# Altium schematic sheet stm32f1.SchDoc
size A3
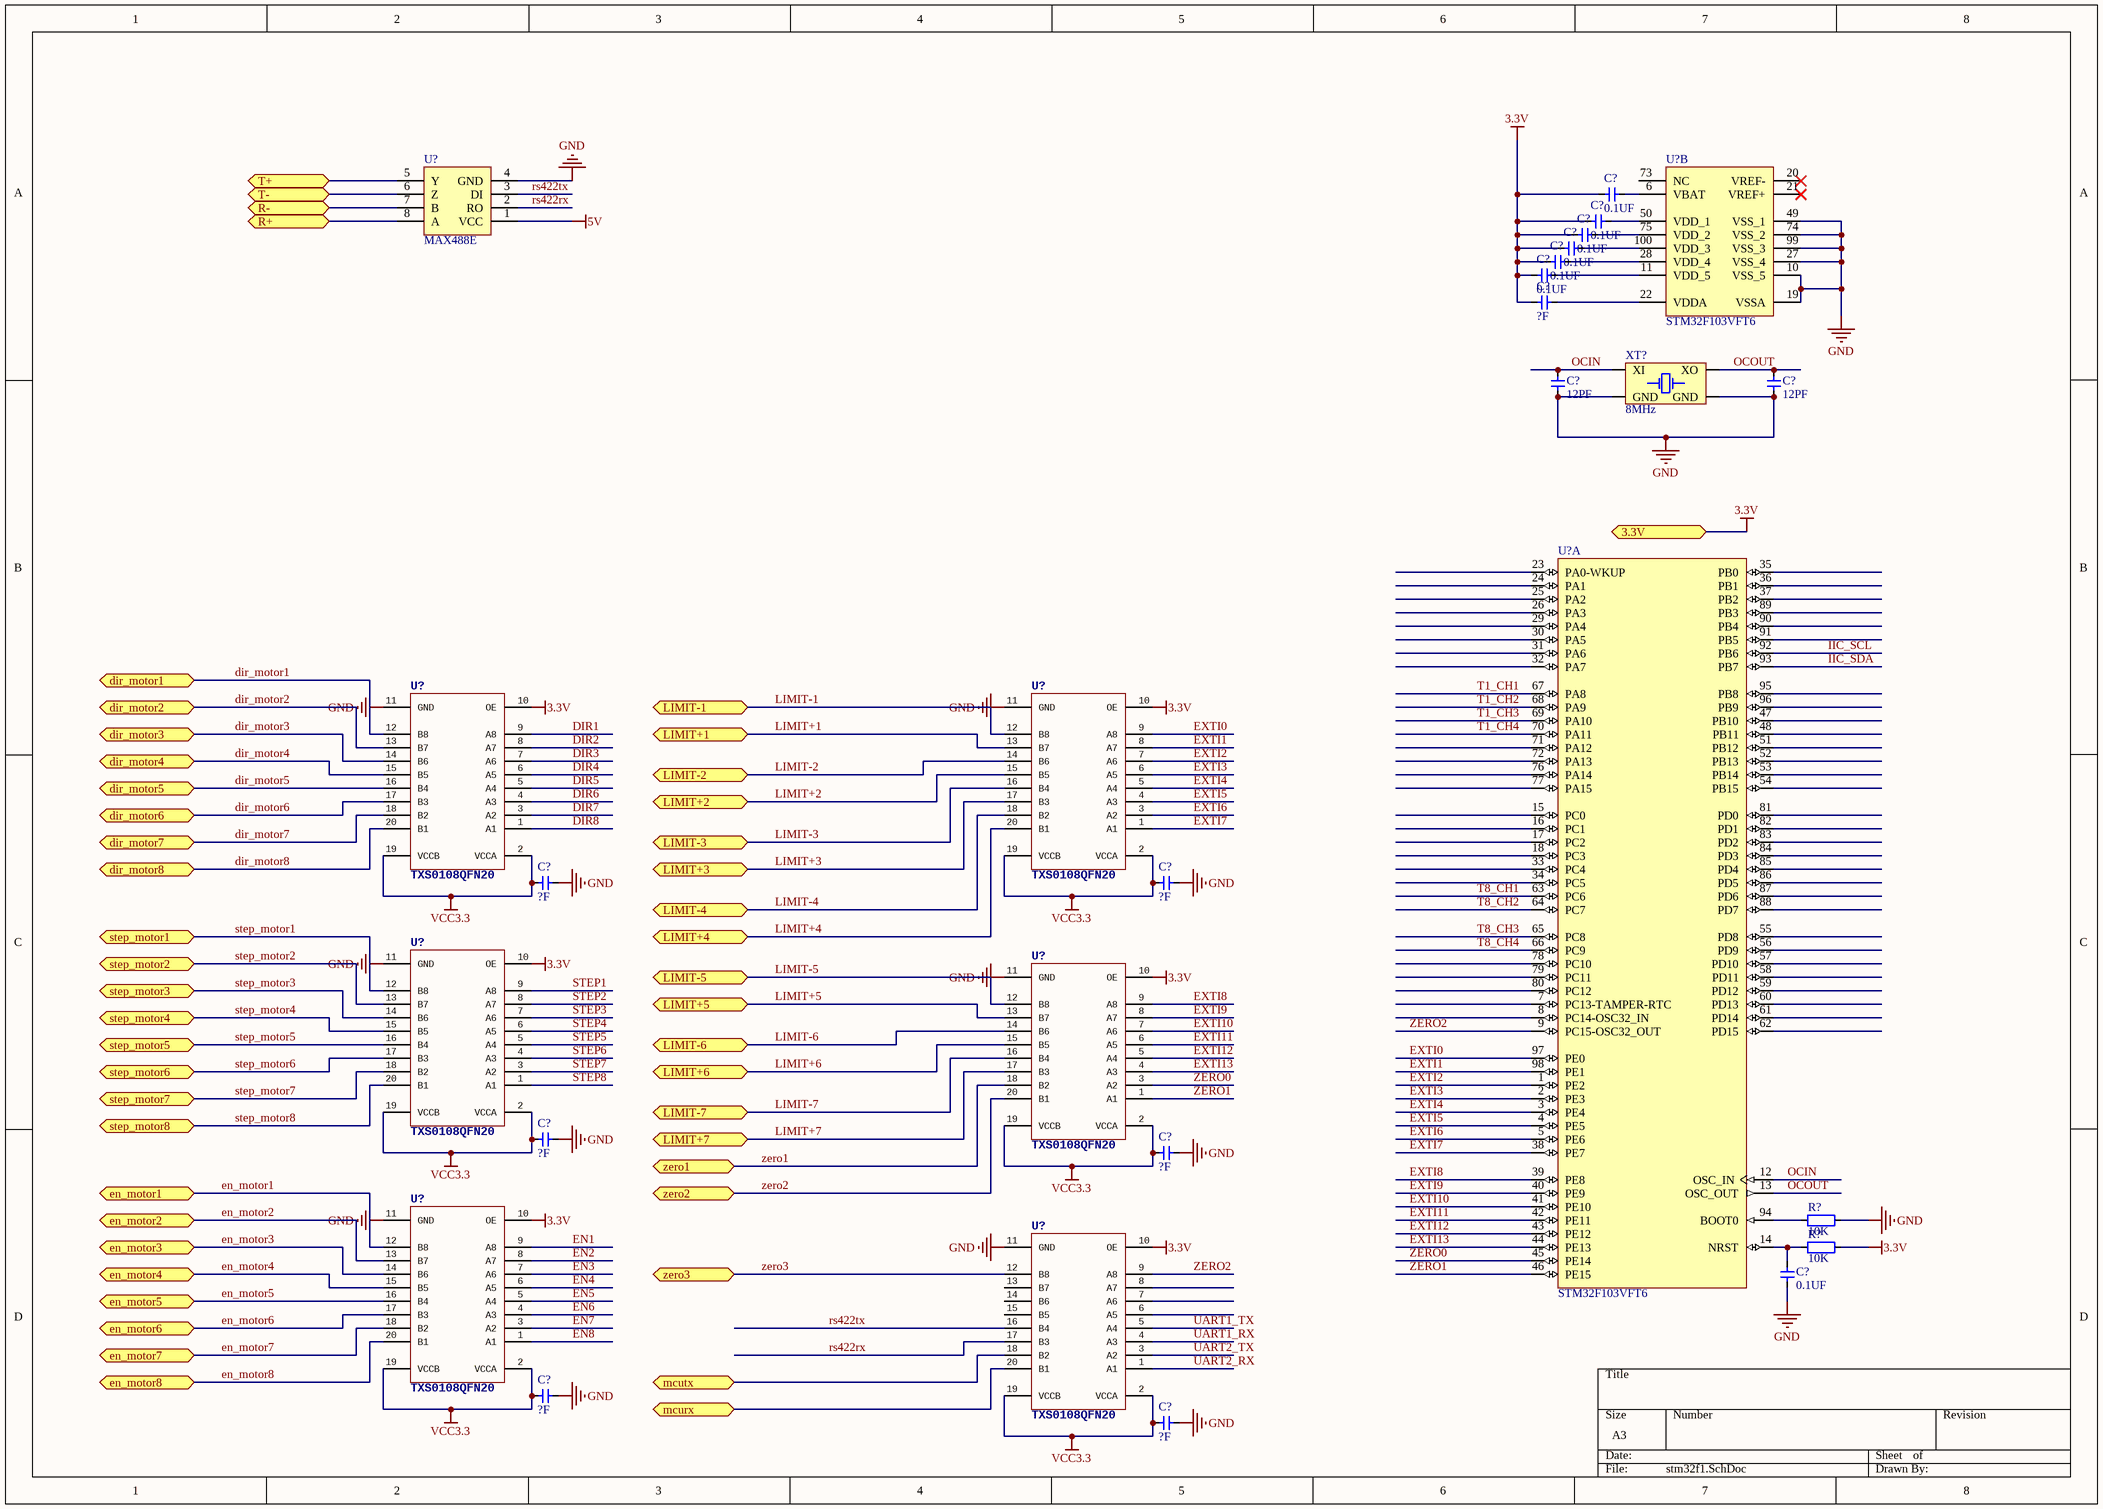
[diagram p0: stm32f1.SchDoc]

## Parts
(Parts that share a designator on the sheet are numbered #1, #2 ... from top to bottom, then left to right.)
C?#1  value 0.1UF  [CAP_0603]  (hidden comment: Cap_0603)
C?#2  value 0.1UF  [CAP_0603]  (hidden comment: Cap_0603)
C?#3  value 0.1UF  [CAP_0603]  (hidden comment: Cap_0603)
C?#4  value 0.1UF  [CAP_0603]  (hidden comment: Cap_0603)
C?#5  value 0.1UF  [CAP_0603]  (hidden comment: Cap_0603)
C?#6  value 0.1UF  [CAP_0603]  (hidden comment: Cap_0603)
C?#7  value ?F  [CAP_0603]  (hidden comment: Cap_0603)
C?#8  value 12PF  [CAP_0603]  (hidden comment: Cap_0603)
C?#9  value 12PF  [CAP_0603]  (hidden comment: Cap_0603)
C?#10  value ?F  [CAP_0603]  (hidden comment: Cap_0603)
C?#11  value ?F  [CAP_0603]  (hidden comment: Cap_0603)
C?#12  value ?F  [CAP_0603]  (hidden comment: Cap_0603)
C?#13  value ?F  [CAP_0603]  (hidden comment: Cap_0603)
C?#14  value 0.1UF  [CAP_0603]  (hidden comment: Cap_0603)
C?#15  value ?F  [CAP_0603]  (hidden comment: Cap_0603)
C?#16  value ?F  [CAP_0603]  (hidden comment: Cap_0603)
R?#1  value 10K  [RES_0603]  (hidden comment: Res_0603)
R?#2  value 10K  [RES_0603]  (hidden comment: Res_0603)
U?#1  STM32F103VFT6  [LQFP100_N]  (part B of 2)
U?#2  MAX488E  [SOP_E150_8]
U?#3  STM32F103VFT6  [LQFP100_N]  (part A of 2)
U?#4  TXS0108QFN20  [QFN20-RGY]
U?#5  TXS0108QFN20  [QFN20-RGY]
U?#6  TXS0108QFN20  [QFN20-RGY]
U?#7  TXS0108QFN20  [QFN20-RGY]
U?#8  TXS0108QFN20  [QFN20-RGY]
U?#9  TXS0108QFN20  [QFN20-RGY]
XT?  value 8MHz  [XT_3225_4]  (hidden comment: XTAL_3225_4P)

## Ports
3.3V, dir_motor1, dir_motor2, dir_motor3, dir_motor4, dir_motor5, dir_motor6, dir_motor7, dir_motor8, en_motor1, en_motor2, en_motor3, en_motor4, en_motor5, en_motor6, en_motor7, en_motor8, LIMIT+1, LIMIT+2, LIMIT+3, LIMIT+4, LIMIT+5, LIMIT+6, LIMIT+7, LIMIT-1, LIMIT-2, LIMIT-3, LIMIT-4, LIMIT-5, LIMIT-6, LIMIT-7, mcurx, mcutx, R+, R-, step_motor1, step_motor2, step_motor3, step_motor4, step_motor5, step_motor6, step_motor7, step_motor8, T+, T-, zero1, zero2, zero3

## Nets
3.3V: C?#1.1 C?#2.1 C?#3.1 C?#4.1 C?#5.1 C?#6.1 C?#7.1 R?#2.2 U?#4.10(OE) U?#5.10(OE) U?#6.10(OE) U?#7.10(OE) U?#8.10(OE) U?#9.10(OE) ; port 3.3V
5V: U?#2.1(VCC)
GND: C?#8.1 C?#9.1 C?#10.1 C?#11.1 C?#12.1 C?#13.1 C?#14.1 C?#15.1 C?#16.1 R?#1.2 U?#1.10(VSS_5) U?#1.19(VSSA) U?#1.27(VSS_4) U?#1.49(VSS_1) U?#1.74(VSS_2) U?#1.99(VSS_3) U?#2.4(GND) U?#4.11(GND) U?#5.11(GND) U?#6.11(GND) U?#7.11(GND) U?#8.11(GND) U?#9.11(GND) XT?.2(GND) XT?.4(GND)
VCC3.3: C?#10.2 C?#11.2 C?#12.2 C?#13.2 C?#15.2 C?#16.2 U?#4.2(VCCA) U?#4.19(VCCB) U?#5.2(VCCA) U?#5.19(VCCB) U?#6.2(VCCA) U?#6.19(VCCB) U?#7.2(VCCA) U?#7.19(VCCB) U?#8.2(VCCA) U?#8.19(VCCB) U?#9.2(VCCA) U?#9.19(VCCB)
DIR1: U?#4.9(A8)
DIR2: U?#4.8(A7)
DIR3: U?#4.7(A6)
DIR4: U?#4.6(A5)
DIR5: U?#4.5(A4)
DIR6: U?#4.4(A3)
DIR7: U?#4.3(A2)
DIR8: U?#4.1(A1)
dir_motor1: U?#4.12(B8) ; port dir_motor1
dir_motor2: U?#4.13(B7) ; port dir_motor2
dir_motor3: U?#4.14(B6) ; port dir_motor3
dir_motor4: U?#4.15(B5) ; port dir_motor4
dir_motor5: U?#4.16(B4) ; port dir_motor5
dir_motor6: U?#4.17(B3) ; port dir_motor6
dir_motor7: U?#4.18(B2) ; port dir_motor7
dir_motor8: U?#4.20(B1) ; port dir_motor8
EN1: U?#8.9(A8)
EN2: U?#8.8(A7)
EN3: U?#8.7(A6)
EN4: U?#8.6(A5)
EN5: U?#8.5(A4)
EN6: U?#8.4(A3)
EN7: U?#8.3(A2)
EN8: U?#8.1(A1)
en_motor1: U?#8.12(B8) ; port en_motor1
en_motor2: U?#8.13(B7) ; port en_motor2
en_motor3: U?#8.14(B6) ; port en_motor3
en_motor4: U?#8.15(B5) ; port en_motor4
en_motor5: U?#8.16(B4) ; port en_motor5
en_motor6: U?#8.17(B3) ; port en_motor6
en_motor7: U?#8.18(B2) ; port en_motor7
en_motor8: U?#8.20(B1) ; port en_motor8
EXTI0: U?#3.97(PE0) U?#5.9(A8)
EXTI1: U?#3.98(PE1) U?#5.8(A7)
EXTI2: U?#3.1(PE2) U?#5.7(A6)
EXTI3: U?#3.2(PE3) U?#5.6(A5)
EXTI4: U?#3.3(PE4) U?#5.5(A4)
EXTI5: U?#3.4(PE5) U?#5.4(A3)
EXTI6: U?#3.5(PE6) U?#5.3(A2)
EXTI7: U?#3.38(PE7) U?#5.1(A1)
EXTI8: U?#3.39(PE8) U?#7.9(A8)
EXTI9: U?#3.40(PE9) U?#7.8(A7)
EXTI10: U?#3.41(PE10) U?#7.7(A6)
EXTI11: U?#3.42(PE11) U?#7.6(A5)
EXTI12: U?#3.43(PE12) U?#7.5(A4)
EXTI13: U?#3.44(PE13) U?#7.4(A3)
IIC_SCL: U?#3.92(PB6)
IIC_SDA: U?#3.93(PB7)
LIMIT+1: U?#5.13(B7) ; port LIMIT+1
LIMIT+2: U?#5.15(B5) ; port LIMIT+2
LIMIT+3: U?#5.17(B3) ; port LIMIT+3
LIMIT+4: U?#5.20(B1) ; port LIMIT+4
LIMIT+5: U?#7.13(B7) ; port LIMIT+5
LIMIT+6: U?#7.15(B5) ; port LIMIT+6
LIMIT+7: U?#7.17(B3) ; port LIMIT+7
LIMIT-1: U?#5.12(B8) ; port LIMIT-1
LIMIT-2: U?#5.14(B6) ; port LIMIT-2
LIMIT-3: U?#5.16(B4) ; port LIMIT-3
LIMIT-4: U?#5.18(B2) ; port LIMIT-4
LIMIT-5: U?#7.12(B8) ; port LIMIT-5
LIMIT-6: U?#7.14(B6) ; port LIMIT-6
LIMIT-7: U?#7.16(B4) ; port LIMIT-7
mcurx: U?#9.20(B1) ; port mcurx
mcutx: U?#9.18(B2) ; port mcutx
OCIN: C?#8.2 U?#3.12(OSC_IN) XT?.1(XI)
OCOUT: C?#9.2 U?#3.13(OSC_OUT) XT?.3(XO)
R+: U?#2.8(A) ; port R+
R-: U?#2.7(B) ; port R-
rs422rx: U?#2.2(RO) U?#9.17(B3)
rs422tx: U?#2.3(DI) U?#9.16(B4)
STEP1: U?#6.9(A8)
STEP2: U?#6.8(A7)
STEP3: U?#6.7(A6)
STEP4: U?#6.6(A5)
STEP5: U?#6.5(A4)
STEP6: U?#6.4(A3)
STEP7: U?#6.3(A2)
STEP8: U?#6.1(A1)
step_motor1: U?#6.12(B8) ; port step_motor1
step_motor2: U?#6.13(B7) ; port step_motor2
step_motor3: U?#6.14(B6) ; port step_motor3
step_motor4: U?#6.15(B5) ; port step_motor4
step_motor5: U?#6.16(B4) ; port step_motor5
step_motor6: U?#6.17(B3) ; port step_motor6
step_motor7: U?#6.18(B2) ; port step_motor7
step_motor8: U?#6.20(B1) ; port step_motor8
T1_CH1: U?#3.67(PA8)
T1_CH2: U?#3.68(PA9)
T1_CH3: U?#3.69(PA10)
T1_CH4: U?#3.70(PA11)
T8_CH1: U?#3.63(PC6)
T8_CH2: U?#3.64(PC7)
T8_CH3: U?#3.65(PC8)
T8_CH4: U?#3.66(PC9)
T+: U?#2.5(Y) ; port T+
T-: U?#2.6(Z) ; port T-
UART1_RX: U?#9.4(A3)
UART1_TX: U?#9.5(A4)
UART2_RX: U?#9.1(A1)
UART2_TX: U?#9.3(A2)
ZERO0: U?#3.45(PE14) U?#7.3(A2)
zero1: U?#3.46(PE15) U?#7.1(A1) U?#7.18(B2) ; port zero1
zero2: U?#3.9(PC15-OSC32_OUT) U?#7.20(B1) U?#9.9(A8) ; port zero2
zero3: U?#9.12(B8) ; port zero3
NetC?#1_2: C?#1.2 U?#1.6(VBAT)
NetC?#2_2: C?#2.2 U?#1.50(VDD_1)
NetC?#3_2: C?#3.2 U?#1.75(VDD_2)
NetC?#4_2: C?#4.2 U?#1.100(VDD_3)
NetC?#5_2: C?#5.2 U?#1.28(VDD_4)
NetC?#6_2: C?#6.2 U?#1.11(VDD_5)
NetC?#7_2: C?#7.2 U?#1.22(VDDA)
NetC?#14_2: C?#14.2 R?#2.1 U?#3.14(NRST)
NetR?#1_1: R?#1.1 U?#3.94(BOOT0)

Not connected (* = marked no-connect by the designer): U?#1 20(VREF-)* 21(VREF+)* 73(NC); U?#3 7(PC13-TAMPER-RTC) 8(PC14-OSC32_IN) 15(PC0) 16(PC1) 17(PC2) 18(PC3) 23(PA0-WKUP) 24(PA1) 25(PA2) 26(PA3) 29(PA4) 30(PA5) 31(PA6) 32(PA7) 33(PC4) 34(PC5) 35(PB0) 36(PB1) 37(PB2) 47(PB10) 48(PB11) 51(PB12) 52(PB13) 53(PB14) 54(PB15) 55(PD8) 56(PD9) 57(PD10) 58(PD11) 59(PD12) 60(PD13) 61(PD14) 62(PD15) 71(PA12) 72(PA13) 76(PA14) 77(PA15) 78(PC10) 79(PC11) 80(PC12) 81(PD0) 82(PD1) 83(PD2) 84(PD3) 85(PD4) 86(PD5) 87(PD6) 88(PD7) 89(PB3) 90(PB4) 91(PB5) 95(PB8) 96(PB9); U?#9 6(A5) 7(A6) 8(A7) 13(B7) 14(B6) 15(B5)

## Library data of the parts
C?#1-C?#16 = Cap_0603: Capacitor
R?#1 R?#2 = Res_0603: Resistor
U?#1 U?#3 = STM32F103VFT6: STM32 ARM-based 32-bit MCU Performance Line with 768 kB Flash, 96 kB Internal RAM, -40 to +85癈 Temperature, 100-Pin LQFP, Tray; DatasheetVersion: rev2.0, Nov-2010; PackageVersion: rev13, Apr-2011; PackageReference: LQFP100; PackageDescription: 100-Pin Low-Profile Quad Flat Pack, 14 x 14 mm Body, 0.5 mm Pitch (LQFP100); ComponentLink1Description: Manufacturer URL; ComponentLink1URL: http://www.st.com/; ComponentLink2Description: STM32F103 Datasheet; ComponentLink2URL: http://www.st.com/internet/com/TECHNICAL_RESOURCES/TECHNICAL_LITERATURE/DATASHEET/CD00253742.pdf; ComponentLink3Description: STM32 Family Web Page; ComponentLink3URL: www.st.com/stm32
U?#4-U?#9 = TXS0108QFN20: PARTNO: TXS0108ERGYR
XT? = XTAL_3225_4P: Crystal Oscillator